# EAGLE design Brennan-YSL-NCE-CAB-Bus (EAGLE 7.7.0)
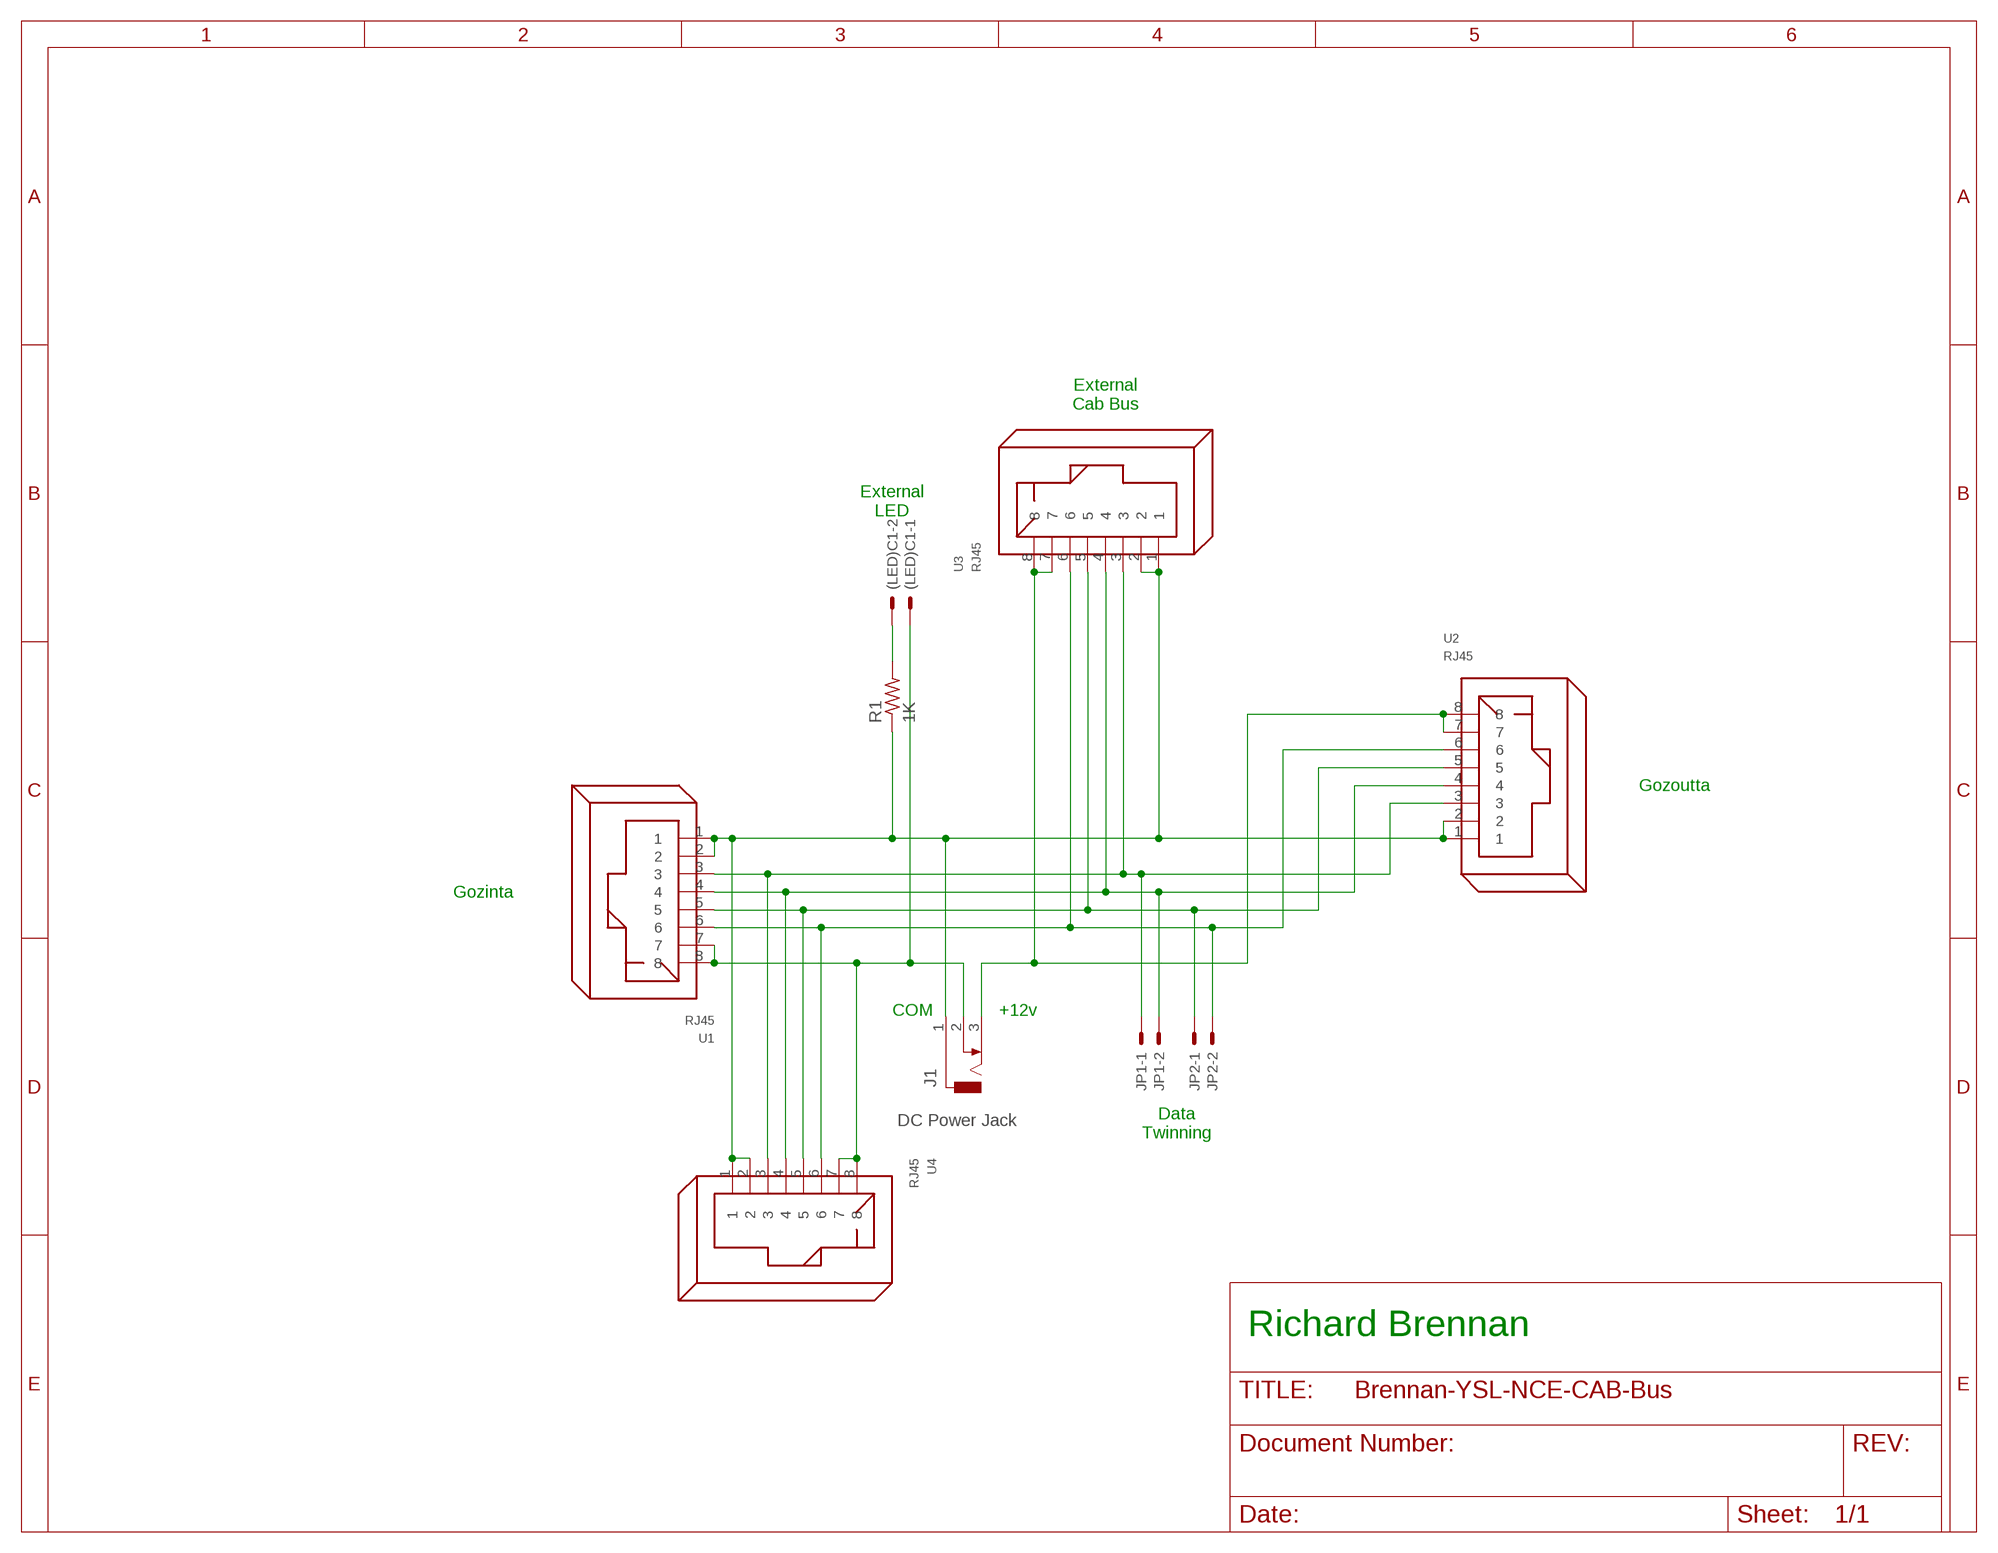
[diagram p0: schematic, sheet 1]

## Parts
(LED)C1  22-23-2021  [22-23-2021]
J1  DC Power Jack  DCJ0303  [DCJ0303]
JP1  22-23-2021  [22-23-2021]
JP2  22-23-2021  [22-23-2021]
R1  1K  R-US_0207/10  [0207/10]
U1  RJ45  [RJ45]
U2  RJ45  [RJ45]
U3  RJ45  [RJ45]
U4  RJ45  [RJ45]

## Nets
+12V: J1.3 U2.7 U2.8 U3.7 U3.8
A2: JP1.1 U1.3 U2.3 U3.3 U4.3
B2: JP2.2 U1.6 U2.6 U3.6 U4.6
COM: J1.1 R1.1 U1.1 U1.2 U2.1 U2.2 U3.1 U3.2 U4.1 U4.2
DATA-A: JP1.2 U1.4 U2.4 U3.4 U4.4
DATA-B: JP2.1 U1.5 U2.5 U3.5 U4.5
N$4: (LED)C1.2 R1.2
N$10: (LED)C1.1 J1.2 U1.7 U1.8 U4.7 U4.8

## Notes on the sheet
- External
  Cab Bus
- External
  LED
- Gozoutta
- Gozinta
- COM | +12v
- Data
  Twinning
- Richard Brennan

## Library data of the parts
(LED)C1 JP1 JP2 = con-molex:22-23-2021: .100" (2.54mm) Center Header - 2 Pin; MF: MOLEX; MPN: 22-23-2021; OC_FARNELL: 1462926; OC_NEWARK: 25C3832
J1 = con-jack:DCJ0303: DC POWER JACK Source: DCJ0303.pdf; OC_FARNELL: unknown; OC_NEWARK: unknown
R1 = rcl:R-US_: RESISTOR, American symbol
U1-U4 = con-rj:RJ45: RJ45 RJ45 jacks side mounted http://www.tycoelectronics.com; OC_NEWARK: unknown

## Net classes
0 default: clearance 0.205 mm

## Board
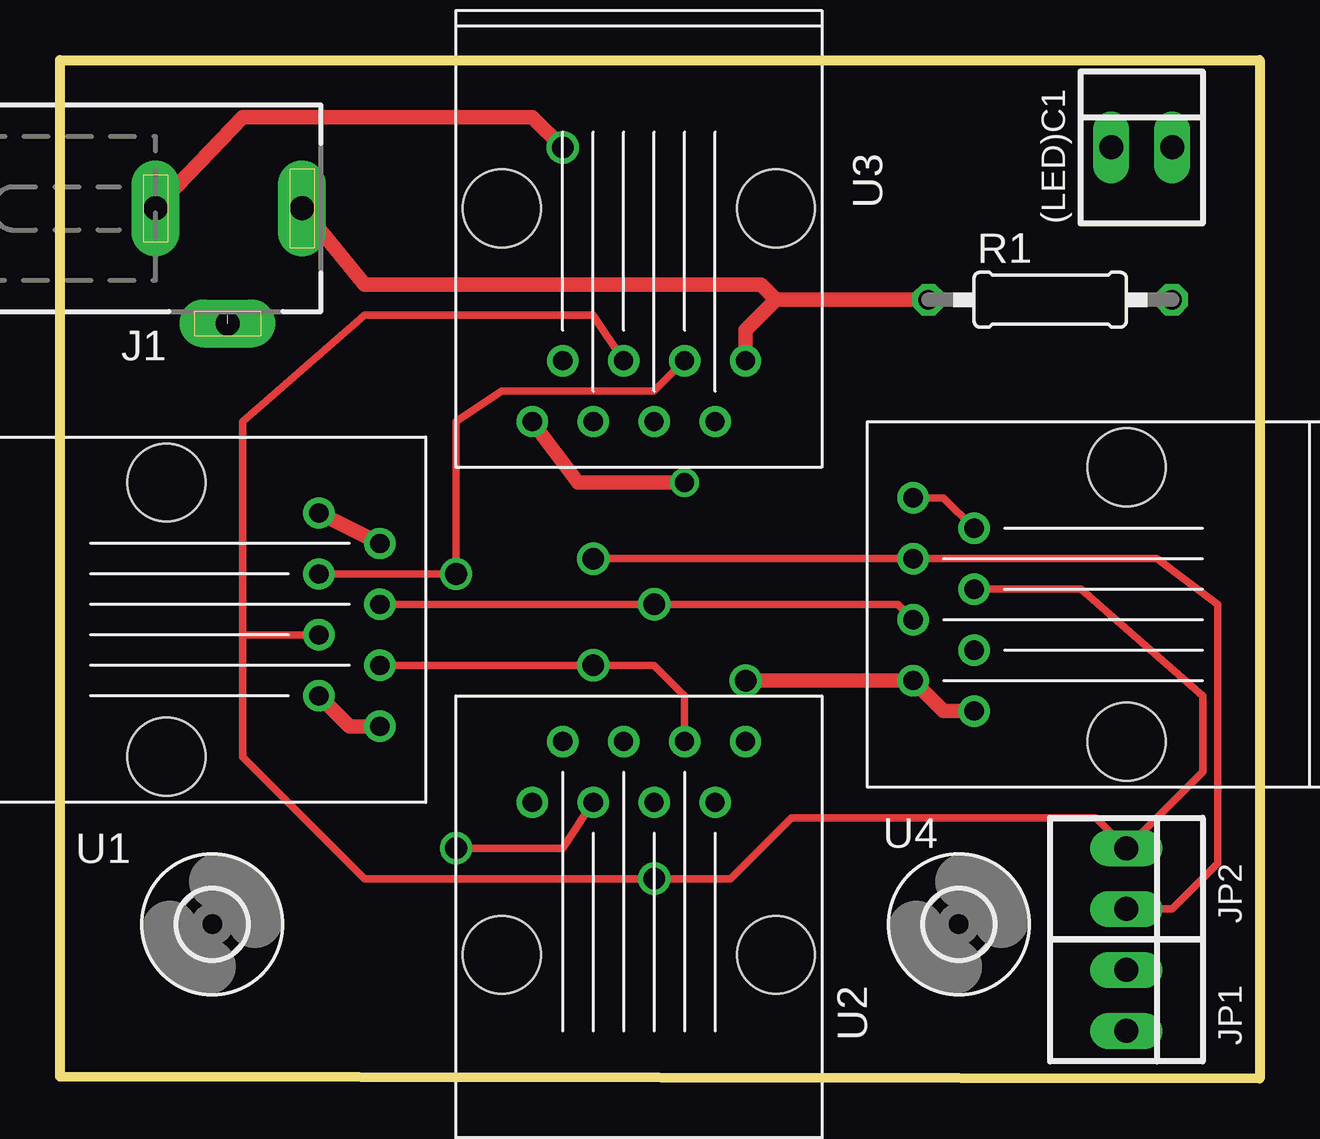
[diagram p1: board, top side]
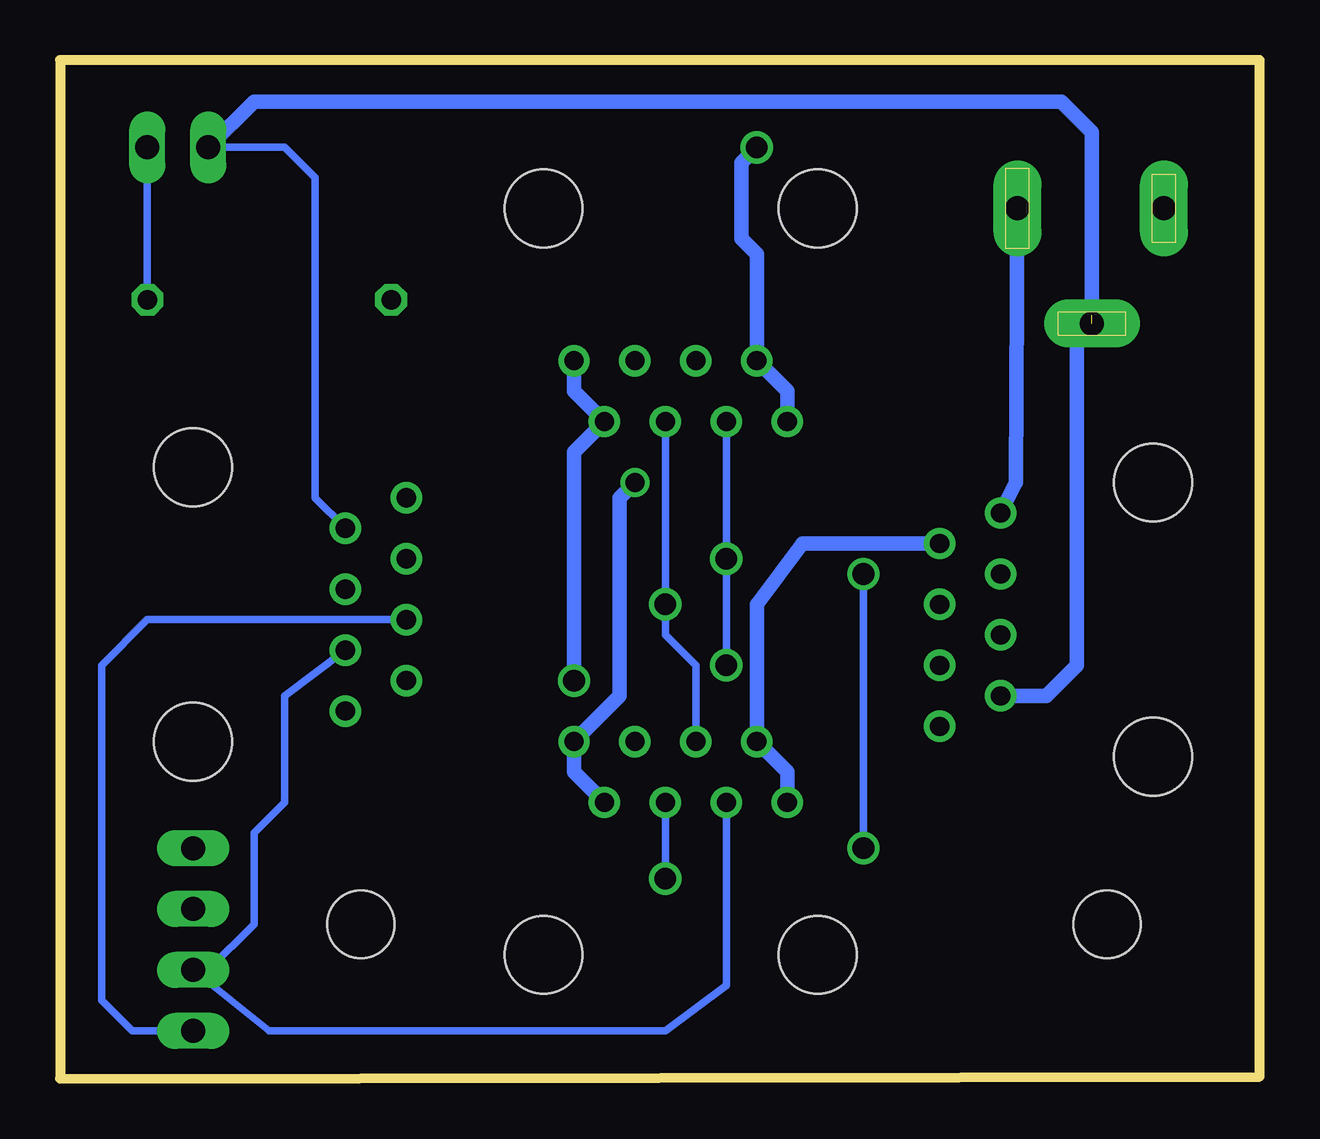
[diagram p2: board, bottom side, seen from below]

Size 50 x 42.46 mm. Coordinates in mm from the lower left corner, seen from the top.
Outline: 0,0.08 0,42.46 50,42.46 50,0 0,0.08
Copper layers (1*16): Top 0.035mm / dielectric 1.5mm / Bottom 0.035mm
Design rules "default": minimum track width 10mil, minimum drill 24mil, track to track 8mil, track to pad 8mil, pad to pad 8mil, via to via 8mil, smd to smd 8mil, copper to edge 40mil, drill to drill 8mil, minimum pad ring 10mil, minimum via ring 8mil, stop-mask expansion 4mil, vias tented up to drill 0mil, thermal gap 10mil

### Footprints (pad centres in the part's own frame; a part is rotated, then mirrored left to right if it is on the bottom)
22-23-2021 = drill 1 long: 1 -1.27,0; 2 1.27,0
DCJ0303 = drill 1 pad 2 long: 1 0,3.1; 2 4.8,0; 3 0,-3
0207/10 = drill 0.813 octagon: 1 -5.08,0; 2 5.08,0
RJ45 = drill 0.8: 1 -6.35,-4.445; 2 -8.89,-3.175; 3 -6.35,-1.905; 4 -8.89,-0.635; 5 -6.35,0.635; 6 -8.89,1.905; 7 -6.35,3.175; 8 -8.89,4.445 | hole 3.25: 0,-5.715; 0,5.715
2,8 = hole 2.8: 0,0

### Placement (x,y rotation side)
(LED)C1  45.09,38.81 0 top
J1  6.99,36.27 270 top
JP1  44.45,3.25 270 top
JP2  44.45,8.34 270 top
R1  41.27,32.46 0 top
U1  4.45,19.13 180 top
U2  24.13,5.16 270 top
U3  24.13,36.27 90 top
U4  44.45,19.76 0 top
U$1  [2,8]  6.35,6.43 0 top
U$2  [2,8]  37.47,6.43 0 top
U$3  [CA-PROP65WARNING]  31.75,17.86 270 top

### Tracks (layer width: path | path; a pad name or v marks a point on that pad's centre or on a via)
+12V  (via drill 0.8, 0.9)
  Top 0.61: J1.3 7.62,40.09 19.68,40.09 v20.95,38.81 | v26.04,24.84 21.59,24.84 U3.8
  Bottom 0.61: v20.95,38.81 21.59,38.18 21.59,35 20.95,34.37 U3.7 19.68,28.65 U3.8 | U2.7 28.57,12.78 U2.8 26.67,15.96 26.67,24.21 v26.04,24.84
A2  (via drill 0.9)
  Top 0.305: U2.3 20.95,9.61 v16.51,9.61 | U1.3 v16.51,21.03 16.51,27.38 18.41,28.65 24.77,28.65 U3.3
  Bottom 0.305: v16.51,9.61 v16.51,21.03 | U4.3 40.64,15.96 40.64,11.51 41.91,10.24 41.91,6.43 43.81,4.53 JP1.1 41.27,1.99 24.77,1.99 22.23,3.89 U2.3
B2  (via drill 0.9)
  Top 0.305: U1.6 v22.23,17.22 24.77,17.22 26.04,15.96 U2.6 | v22.23,21.67 U4.6 45.72,21.67 48.26,19.76 48.26,8.97 46.35,7.07 JP2.2
  Bottom 0.305: U3.6 v22.23,21.67 v22.23,17.22
COM  (via drill 0.9)
  Top 0.61: R1.1 29.84,32.46 | 29.84,32.46 28.57,31.19 U3.1 | v28.57,16.59 U4.2 36.83,15.32 U4.1 | U1.1 U1.2 | J1.1 12.7,33.1 29.21,33.1 29.84,32.46
  Bottom 0.61: v28.57,16.59 28.57,26.11 U3.2 28.57,28.65 U3.1 | J1.1 10.16,24.84 U1.1 | U1.2 19.05,22.3 20.95,19.76 U2.2 19.68,12.78 U2.1
DATA-A  (via drill 0.9)
  Top 0.305: U1.4 v24.77,19.76 34.92,19.76 U4.4
  Bottom 0.305: U2.4 23.5,17.22 24.77,18.49 v24.77,19.76 U3.4 | U4.4 46.35,19.13 48.26,17.22 48.26,3.25 46.99,1.99 JP1.2
DATA-B  (via drill 0.9)
  Top 0.305: U3.5 22.23,31.83 12.7,31.83 7.62,27.38 7.62,18.49 | 7.62,18.49 U1.5 | 7.62,18.49 7.62,13.42 12.7,8.34 v24.77,8.34 27.94,8.34 30.48,10.88 43.18,10.88 JP2.1 47.62,12.78 47.62,15.96 42.55,20.4 U4.5
  Bottom 0.305: U2.5 v24.77,8.34
N$4
  Bottom 0.305: (LED)C1.2 R1.2
N$10  (1 unrouted)
  Top 0.305: U4.8 36.83,24.21 U4.7
  Top 0.61: U1.7 12.06,14.69 U1.8
  Bottom 0.305: (LED)C1.1 40.64,38.81 39.37,37.55 39.37,24.21 U4.7
  Bottom 0.61: U1.7 8.89,15.96 7.62,17.22 7.62,30.56 J1.2 | 6.99,31.83 6.99,39.45 8.26,40.72 41.91,40.72 (LED)C1.1

### Text on the board
bDocu: YSL-DCC-ConnectorV2.6 | Richard Brennan / Seth Neumann / 20210804